# EAGLE design pdbV2.0 (EAGLE 9.6.2)
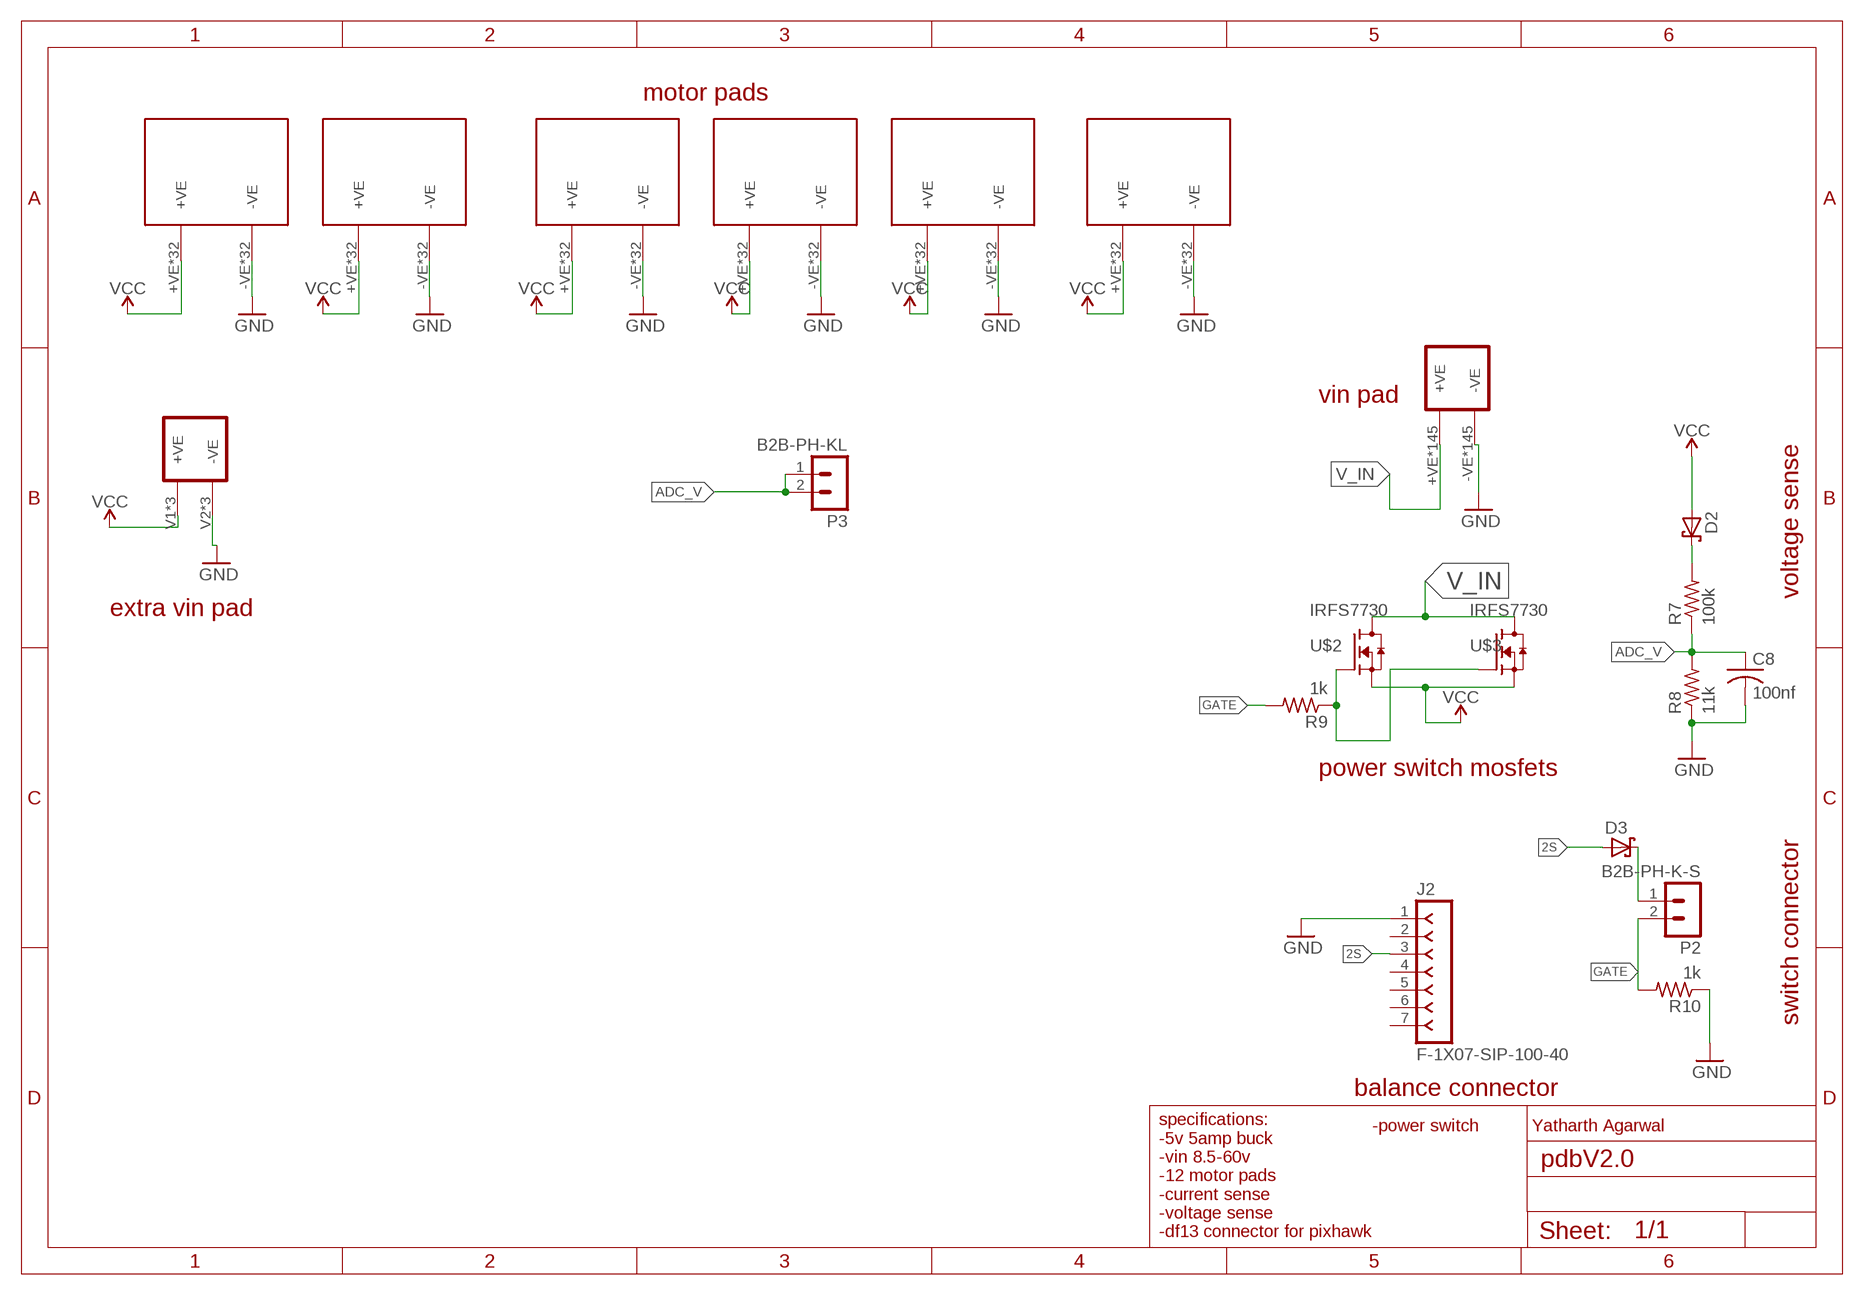
[diagram p0: schematic, sheet 1]

## Parts
C8  100nf  C-USC0805  [C0805]
D2  1PS76SB70,115  [SOD323(F)]
D3  1PS76SB70,115  [SOD323(F)]
J2  F-1X07-SIP-100-40  [SIP-100-07-40]
P2  B2B-PH-K-S  [B2B-PH-K-S]
P3  B2B-PH-KL  [B2B-PH-K-S]
R7  100k  R-US_R0805  [R0805]
R8  11k  R-US_R0805  [R0805]
R9  1k  R-US_R0805  [R0805]
R10  1k  R-US_R0805  [R0805]
T1  BATTERY_PAD  [BATTERY_PAD]
T2  MOTOR_PAD  [MOTOR_PAD]
T3  MOTOR_PAD  [MOTOR_PAD]
T4  MOTOR_PAD  [MOTOR_PAD]
T5  MOTOR_PAD  [MOTOR_PAD]
T6  MOTOR_PAD  [MOTOR_PAD]
T7  MOTOR_PAD  [MOTOR_PAD]
U$1  CONPAD  [CONPAD]
U$2  IRFS7730  [TO254P1524X457-3N]
U$3  IRFS7730  [TO254P1524X457-3N]

## Nets
2S: D3.2(A) J2.3
ADC_V: C8.1 P3.1 P3.2 R7.1 R8.2
GATE: P2.2 R9.2 R10.2
GND: C8.2 J2.1 R8.1 R10.1 T1.-VE T1.-VE_1(-VE) T1.V109(-VE) T1.V110(-VE) T1.V111(-VE) T1.V112(-VE) T1.V113(-VE) T1.V114(-VE) T1.V115(-VE) T1.V116(-VE) T1.V117(-VE) T1.V118(-VE) T1.V119(-VE) T1.V121(-VE) T1.V122(-VE) T1.V123(-VE) T1.V124(-VE) T1.V125(-VE) T1.V126(-VE) T1.V127(-VE) T1.V128(-VE) T1.V129(-VE) T1.V130(-VE) T1.V131(-VE) T1.V133(-VE) T1.V134(-VE) T1.V135(-VE) T1.V136(-VE) T1.V137(-VE) T1.V138(-VE) T1.V139(-VE) T1.V140(-VE) T1.V141(-VE) T1.V142(-VE) T1.V143(-VE) T1.V145(-VE) T1.V146(-VE) T1.V147(-VE) T1.V148(-VE) T1.V149(-VE) T1.V150(-VE) T1.V151(-VE) T1.V152(-VE) T1.V153(-VE) T1.V154(-VE) T1.V155(-VE) T1.V157(-VE) T1.V158(-VE) T1.V159(-VE) T1.V160(-VE) T1.V161(-VE) T1.V162(-VE) T1.V163(-VE) T1.V164(-VE) T1.V165(-VE) T1.V166(-VE) T1.V167(-VE) T1.V169(-VE) T1.V170(-VE) T1.V171(-VE) T1.V172(-VE) T1.V173(-VE) T1.V174(-VE) T1.V175(-VE) T1.V176(-VE) T1.V177(-VE) T1.V178(-VE) T1.V179(-VE) T1.V181(-VE) T1.V182(-VE) T1.V183(-VE) T1.V184(-VE) T1.V185(-VE) T1.V186(-VE) T1.V187(-VE) T1.V188(-VE) T1.V189(-VE) T1.V190(-VE) T1.V191(-VE) T1.V193(-VE) T1.V194(-VE) T1.V195(-VE) T1.V196(-VE) T1.V197(-VE) T1.V198(-VE) T1.V199(-VE) T1.V200(-VE) T1.V201(-VE) T1.V202(-VE) T1.V203(-VE) T1.V232(-VE) T1.V233(-VE) T1.V234(-VE) T1.V235(-VE) T1.V236(-VE) T1.V237(-VE) T1.V238(-VE) T1.V239(-VE) T1.V240(-VE) T1.V241(-VE) T1.V242(-VE) T1.V243(-VE) T1.V244(-VE) T1.V245(-VE) T1.V246(-VE) T1.V247(-VE) T1.V248(-VE) T1.V249(-VE) T1.V250(-VE) T1.V251(-VE) T1.V252(-VE) T1.V253(-VE) T1.V254(-VE) T1.V255(-VE) T1.V256(-VE) T1.V257(-VE) T1.V258(-VE) T1.V259(-VE) T1.V260(-VE) T1.V261(-VE) T1.V262(-VE) T1.V263(-VE) T1.V264(-VE) T1.V265(-VE) T1.V266(-VE) T1.V267(-VE) T1.V268(-VE) T1.V269(-VE) T1.V270(-VE) T1.V271(-VE) T1.V272(-VE) T1.V273(-VE) T1.V274(-VE) T1.V275(-VE) T1.V276(-VE) T1.V277(-VE) T1.V278(-VE) T1.V279(-VE) T1.V280(-VE) T1.V281(-VE) T1.V282(-VE) T1.V283(-VE) T1.V284(-VE) T1.V285(-VE) T1.V286(-VE) T2.-VE T2.-VE_1(-VE) T2.V32(-VE) T2.V33(-VE) T2.V34(-VE) T2.V35(-VE) T2.V36(-VE) T2.V37(-VE) T2.V38(-VE) T2.V39(-VE) T2.V40(-VE) T2.V41(-VE) T2.V42(-VE) T2.V43(-VE) T2.V44(-VE) T2.V45(-VE) T2.V46(-VE) T2.V47(-VE) T2.V48(-VE) T2.V49(-VE) T2.V50(-VE) T2.V51(-VE) T2.V52(-VE) T2.V53(-VE) T2.V54(-VE) T2.V55(-VE) T2.V56(-VE) T2.V57(-VE) T2.V58(-VE) T2.V59(-VE) T2.V60(-VE) T2.V61(-VE) T3.-VE T3.-VE_1(-VE) T3.V32(-VE) T3.V33(-VE) T3.V34(-VE) T3.V35(-VE) T3.V36(-VE) T3.V37(-VE) T3.V38(-VE) T3.V39(-VE) T3.V40(-VE) T3.V41(-VE) T3.V42(-VE) T3.V43(-VE) T3.V44(-VE) T3.V45(-VE) T3.V46(-VE) T3.V47(-VE) T3.V48(-VE) T3.V49(-VE) T3.V50(-VE) T3.V51(-VE) T3.V52(-VE) T3.V53(-VE) T3.V54(-VE) T3.V55(-VE) T3.V56(-VE) T3.V57(-VE) T3.V58(-VE) T3.V59(-VE) T3.V60(-VE) T3.V61(-VE) T4.-VE T4.-VE_1(-VE) T4.V32(-VE) T4.V33(-VE) T4.V34(-VE) T4.V35(-VE) T4.V36(-VE) T4.V37(-VE) T4.V38(-VE) T4.V39(-VE) T4.V40(-VE) T4.V41(-VE) T4.V42(-VE) T4.V43(-VE) T4.V44(-VE) T4.V45(-VE) T4.V46(-VE) T4.V47(-VE) T4.V48(-VE) T4.V49(-VE) T4.V50(-VE) T4.V51(-VE) T4.V52(-VE) T4.V53(-VE) T4.V54(-VE) T4.V55(-VE) T4.V56(-VE) T4.V57(-VE) T4.V58(-VE) T4.V59(-VE) T4.V60(-VE) T4.V61(-VE) T5.-VE T5.-VE_1(-VE) T5.V32(-VE) T5.V33(-VE) T5.V34(-VE) T5.V35(-VE) T5.V36(-VE) T5.V37(-VE) T5.V38(-VE) T5.V39(-VE) T5.V40(-VE) T5.V41(-VE) T5.V42(-VE) T5.V43(-VE) T5.V44(-VE) T5.V45(-VE) T5.V46(-VE) T5.V47(-VE) T5.V48(-VE) T5.V49(-VE) T5.V50(-VE) T5.V51(-VE) T5.V52(-VE) T5.V53(-VE) T5.V54(-VE) T5.V55(-VE) T5.V56(-VE) T5.V57(-VE) T5.V58(-VE) T5.V59(-VE) T5.V60(-VE) T5.V61(-VE) T6.-VE T6.-VE_1(-VE) T6.V32(-VE) T6.V33(-VE) T6.V34(-VE) T6.V35(-VE) T6.V36(-VE) T6.V37(-VE) T6.V38(-VE) T6.V39(-VE) T6.V40(-VE) T6.V41(-VE) T6.V42(-VE) T6.V43(-VE) T6.V44(-VE) T6.V45(-VE) T6.V46(-VE) T6.V47(-VE) T6.V48(-VE) T6.V49(-VE) T6.V50(-VE) T6.V51(-VE) T6.V52(-VE) T6.V53(-VE) T6.V54(-VE) T6.V55(-VE) T6.V56(-VE) T6.V57(-VE) T6.V58(-VE) T6.V59(-VE) T6.V60(-VE) T6.V61(-VE) T7.-VE T7.-VE_1(-VE) T7.V32(-VE) T7.V33(-VE) T7.V34(-VE) T7.V35(-VE) T7.V36(-VE) T7.V37(-VE) T7.V38(-VE) T7.V39(-VE) T7.V40(-VE) T7.V41(-VE) T7.V42(-VE) T7.V43(-VE) T7.V44(-VE) T7.V45(-VE) T7.V46(-VE) T7.V47(-VE) T7.V48(-VE) T7.V49(-VE) T7.V50(-VE) T7.V51(-VE) T7.V52(-VE) T7.V53(-VE) T7.V54(-VE) T7.V55(-VE) T7.V56(-VE) T7.V57(-VE) T7.V58(-VE) T7.V59(-VE) T7.V60(-VE) T7.V61(-VE) U$1.V2(-VE) U$1.V4(-VE) U$1.V6(-VE)
N$8: D3.1(K) P2.1
N$9: D2.1(K) R7.2
N$10: R9.1 U$2.1(G) U$3.1(G)
V_IN: T1.+VE T1.+VE_1(+VE) T1.V1(+VE) T1.V2(+VE) T1.V3(+VE) T1.V4(+VE) T1.V5(+VE) T1.V6(+VE) T1.V7(+VE) T1.V8(+VE) T1.V9(+VE) T1.V10(+VE) T1.V11(+VE) T1.V12(+VE) T1.V13(+VE) T1.V14(+VE) T1.V15(+VE) T1.V16(+VE) T1.V17(+VE) T1.V18(+VE) T1.V19(+VE) T1.V20(+VE) T1.V21(+VE) T1.V22(+VE) T1.V23(+VE) T1.V24(+VE) T1.V25(+VE) T1.V26(+VE) T1.V27(+VE) T1.V28(+VE) T1.V29(+VE) T1.V30(+VE) T1.V31(+VE) T1.V32(+VE) T1.V33(+VE) T1.V34(+VE) T1.V35(+VE) T1.V36(+VE) T1.V37(+VE) T1.V38(+VE) T1.V39(+VE) T1.V40(+VE) T1.V41(+VE) T1.V42(+VE) T1.V43(+VE) T1.V44(+VE) T1.V45(+VE) T1.V46(+VE) T1.V47(+VE) T1.V48(+VE) T1.V49(+VE) T1.V50(+VE) T1.V51(+VE) T1.V52(+VE) T1.V53(+VE) T1.V54(+VE) T1.V55(+VE) T1.V56(+VE) T1.V57(+VE) T1.V58(+VE) T1.V59(+VE) T1.V60(+VE) T1.V61(+VE) T1.V62(+VE) T1.V63(+VE) T1.V64(+VE) T1.V65(+VE) T1.V66(+VE) T1.V67(+VE) T1.V68(+VE) T1.V69(+VE) T1.V70(+VE) T1.V71(+VE) T1.V72(+VE) T1.V73(+VE) T1.V74(+VE) T1.V75(+VE) T1.V76(+VE) T1.V77(+VE) T1.V78(+VE) T1.V79(+VE) T1.V80(+VE) T1.V81(+VE) T1.V82(+VE) T1.V83(+VE) T1.V84(+VE) T1.V85(+VE) T1.V86(+VE) T1.V87(+VE) T1.V88(+VE) T1.V89(+VE) T1.V90(+VE) T1.V91(+VE) T1.V92(+VE) T1.V93(+VE) T1.V94(+VE) T1.V95(+VE) T1.V96(+VE) T1.V97(+VE) T1.V98(+VE) T1.V99(+VE) T1.V100(+VE) T1.V101(+VE) T1.V102(+VE) T1.V103(+VE) T1.V104(+VE) T1.V105(+VE) T1.V106(+VE) T1.V107(+VE) T1.V108(+VE) T1.V120(+VE) T1.V132(+VE) T1.V144(+VE) T1.V156(+VE) T1.V168(+VE) T1.V180(+VE) T1.V192(+VE) T1.V204(+VE) T1.V205(+VE) T1.V206(+VE) T1.V207(+VE) T1.V208(+VE) T1.V209(+VE) T1.V210(+VE) T1.V211(+VE) T1.V212(+VE) T1.V213(+VE) T1.V214(+VE) T1.V215(+VE) T1.V216(+VE) T1.V217(+VE) T1.V218(+VE) T1.V219(+VE) T1.V220(+VE) T1.V221(+VE) T1.V222(+VE) T1.V223(+VE) T1.V224(+VE) T1.V225(+VE) T1.V226(+VE) T1.V227(+VE) T1.V228(+VE) T1.V229(+VE) T1.V230(+VE) T1.V231(+VE) U$2.2(D) U$3.2(D)
VCC: D2.2(A) T2.+VE T2.+VE_1(+VE) T2.V1(+VE) T2.V3(+VE) T2.V4(+VE) T2.V5(+VE) T2.V6(+VE) T2.V7(+VE) T2.V8(+VE) T2.V9(+VE) T2.V10(+VE) T2.V11(+VE) T2.V12(+VE) T2.V13(+VE) T2.V14(+VE) T2.V15(+VE) T2.V16(+VE) T2.V17(+VE) T2.V18(+VE) T2.V19(+VE) T2.V20(+VE) T2.V21(+VE) T2.V22(+VE) T2.V23(+VE) T2.V24(+VE) T2.V25(+VE) T2.V26(+VE) T2.V27(+VE) T2.V28(+VE) T2.V29(+VE) T2.V30(+VE) T2.V31(+VE) T3.+VE T3.+VE_1(+VE) T3.V1(+VE) T3.V3(+VE) T3.V4(+VE) T3.V5(+VE) T3.V6(+VE) T3.V7(+VE) T3.V8(+VE) T3.V9(+VE) T3.V10(+VE) T3.V11(+VE) T3.V12(+VE) T3.V13(+VE) T3.V14(+VE) T3.V15(+VE) T3.V16(+VE) T3.V17(+VE) T3.V18(+VE) T3.V19(+VE) T3.V20(+VE) T3.V21(+VE) T3.V22(+VE) T3.V23(+VE) T3.V24(+VE) T3.V25(+VE) T3.V26(+VE) T3.V27(+VE) T3.V28(+VE) T3.V29(+VE) T3.V30(+VE) T3.V31(+VE) T4.+VE T4.+VE_1(+VE) T4.V1(+VE) T4.V3(+VE) T4.V4(+VE) T4.V5(+VE) T4.V6(+VE) T4.V7(+VE) T4.V8(+VE) T4.V9(+VE) T4.V10(+VE) T4.V11(+VE) T4.V12(+VE) T4.V13(+VE) T4.V14(+VE) T4.V15(+VE) T4.V16(+VE) T4.V17(+VE) T4.V18(+VE) T4.V19(+VE) T4.V20(+VE) T4.V21(+VE) T4.V22(+VE) T4.V23(+VE) T4.V24(+VE) T4.V25(+VE) T4.V26(+VE) T4.V27(+VE) T4.V28(+VE) T4.V29(+VE) T4.V30(+VE) T4.V31(+VE) T5.+VE T5.+VE_1(+VE) T5.V1(+VE) T5.V3(+VE) T5.V4(+VE) T5.V5(+VE) T5.V6(+VE) T5.V7(+VE) T5.V8(+VE) T5.V9(+VE) T5.V10(+VE) T5.V11(+VE) T5.V12(+VE) T5.V13(+VE) T5.V14(+VE) T5.V15(+VE) T5.V16(+VE) T5.V17(+VE) T5.V18(+VE) T5.V19(+VE) T5.V20(+VE) T5.V21(+VE) T5.V22(+VE) T5.V23(+VE) T5.V24(+VE) T5.V25(+VE) T5.V26(+VE) T5.V27(+VE) T5.V28(+VE) T5.V29(+VE) T5.V30(+VE) T5.V31(+VE) T6.+VE T6.+VE_1(+VE) T6.V1(+VE) T6.V3(+VE) T6.V4(+VE) T6.V5(+VE) T6.V6(+VE) T6.V7(+VE) T6.V8(+VE) T6.V9(+VE) T6.V10(+VE) T6.V11(+VE) T6.V12(+VE) T6.V13(+VE) T6.V14(+VE) T6.V15(+VE) T6.V16(+VE) T6.V17(+VE) T6.V18(+VE) T6.V19(+VE) T6.V20(+VE) T6.V21(+VE) T6.V22(+VE) T6.V23(+VE) T6.V24(+VE) T6.V25(+VE) T6.V26(+VE) T6.V27(+VE) T6.V28(+VE) T6.V29(+VE) T6.V30(+VE) T6.V31(+VE) T7.+VE T7.+VE_1(+VE) T7.V1(+VE) T7.V3(+VE) T7.V4(+VE) T7.V5(+VE) T7.V6(+VE) T7.V7(+VE) T7.V8(+VE) T7.V9(+VE) T7.V10(+VE) T7.V11(+VE) T7.V12(+VE) T7.V13(+VE) T7.V14(+VE) T7.V15(+VE) T7.V16(+VE) T7.V17(+VE) T7.V18(+VE) T7.V19(+VE) T7.V20(+VE) T7.V21(+VE) T7.V22(+VE) T7.V23(+VE) T7.V24(+VE) T7.V25(+VE) T7.V26(+VE) T7.V27(+VE) T7.V28(+VE) T7.V29(+VE) T7.V30(+VE) T7.V31(+VE) U$1.V1(+VE) U$1.V3(+VE) U$1.V5(+VE) U$2.3(S) U$3.3(S)
Unconnected: J2.2 J2.4 J2.5 J2.6 J2.7

## Notes on the sheet
- motor pads
- vin pad
- voltage sense
- extra vin pad
- power switch mosfets
- switch connector
- balance connector
- -power switch | Yatharth Agarwal
- specifications:
  -5v 5amp buck
  -vin 8.5-60v
  -12 motor pads
  -current sense
  -voltage sense
  -df13 connector for pixhawk

## Library data of the parts
C8 = rcl:C-US: CAPACITOR, American symbol; SPICEPREFIX: C
D2 D3 = 1PS76SB70_115:1PS76SB70,115: General-purpose Schottky diode General-purpose Schottky diodes in small Surface-Mounted Device (SMD) plastic packages. AAL Eindhoven MK Check prices <https://pricing.snapeda.com/parts/1PS76SB70%2C115/Nexperia%20USA/view-part?ref=eda>; AVAILABILITY: Good; DESCRIPTION: Diode Schottky 70V 70mA (DC) Surface Mount SOD-323; MF: Nexperia USA; MP: 1PS76SB70,115; PACKAGE: SOD323-2 Nexperia USA Inc.; PRICE: None; PURCHASE-URL: https://pricing.snapeda.com/search/part/1PS76SB70,115/?ref=eda
J2 = con-headers-jp:F-1X07-: FEMALE HEADER
P2 P3 = con-JST PH:B2B-PH: JST PH series header 2.00mm pitch disconnectable crimp style connectors, vertical (side entry type), 2 pins
R7-R10 = rcl:R-US_: RESISTOR, American symbol; SPICEPREFIX: R
T1 = pcbV1:BATTERY_PAD
T2-T7 = pcbV1:MOTOR_PAD
U$1 = pcbV1:CONPAD
U$2 U$3 = pcbV1:IRFS7730

## Board
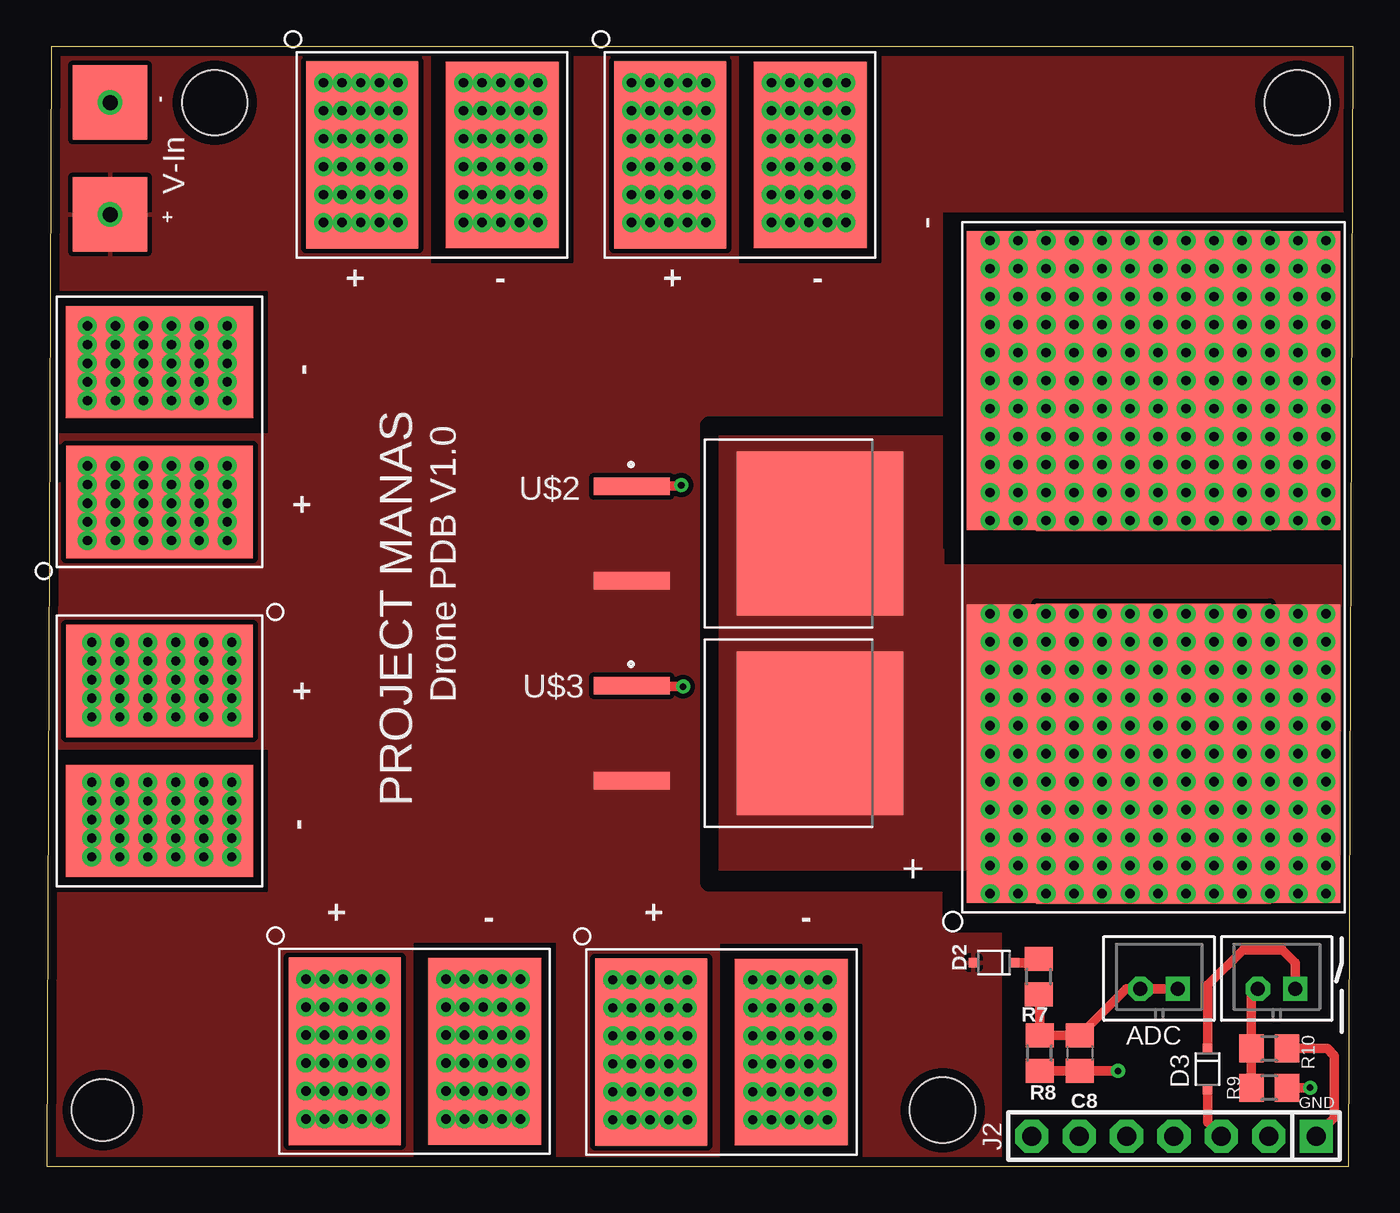
[diagram p1: board, top side]
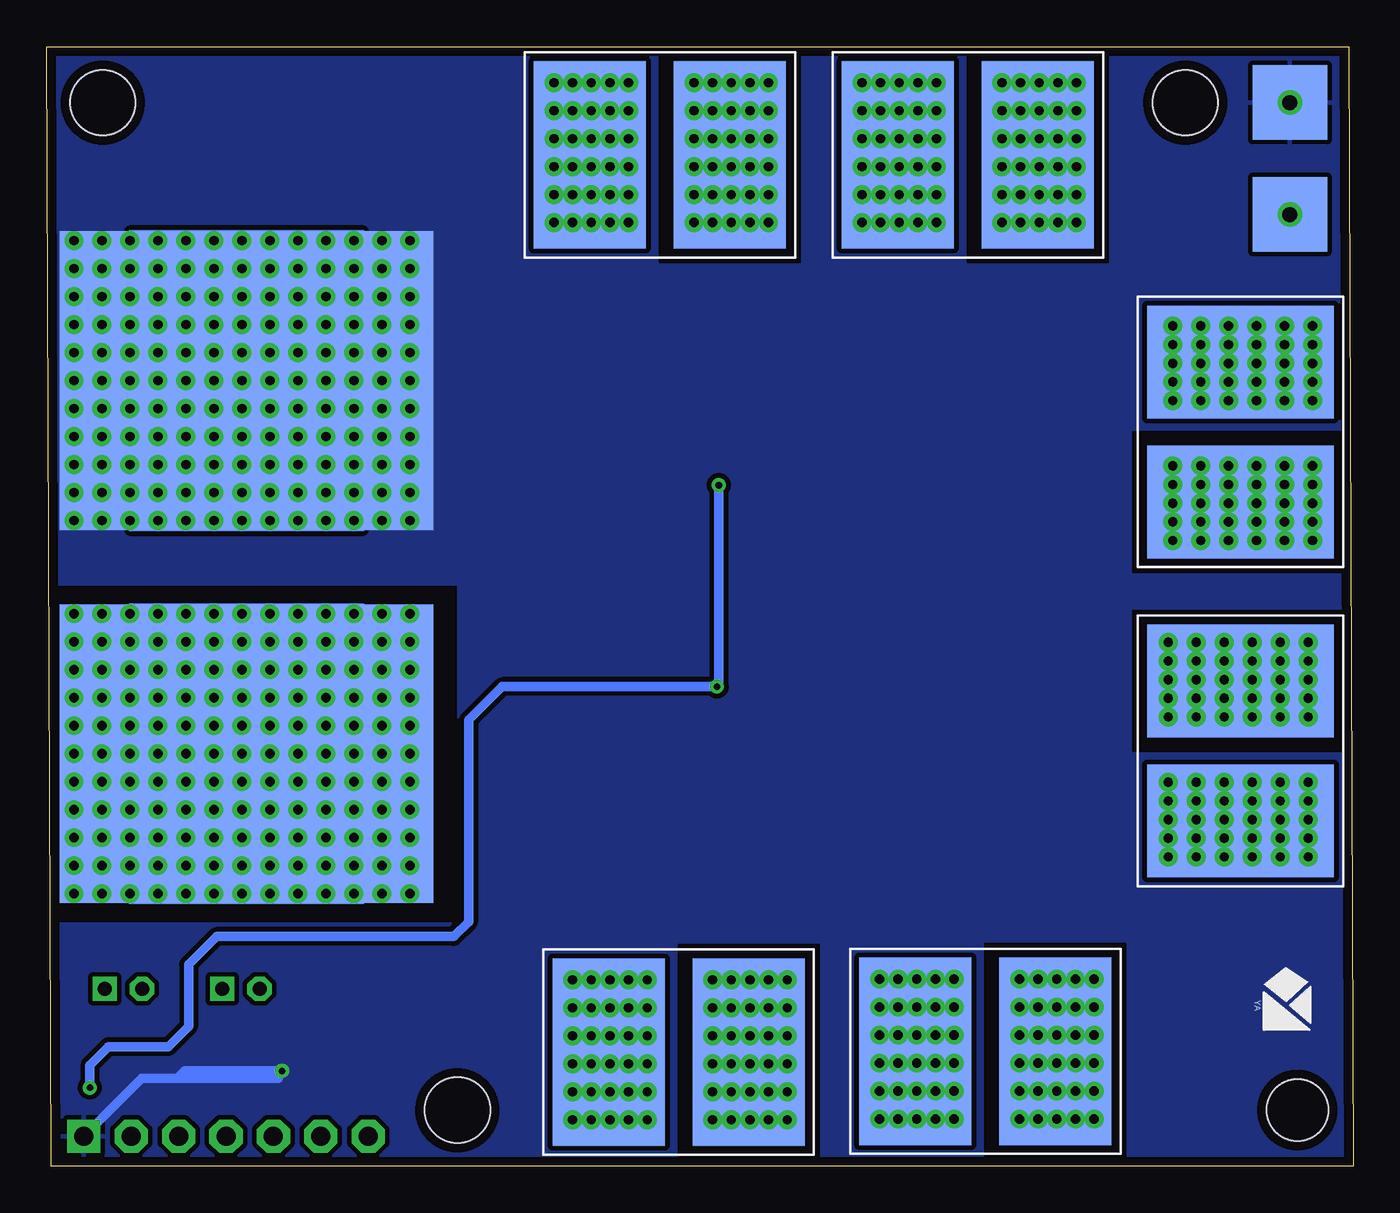
[diagram p2: board, bottom side, seen from below]

Size 70.01 x 60 mm. Coordinates in mm from the lower left corner, seen from the top.
Outline: 0,0 69.76,0 70.01,60 0.25,60 0,0
Copper layers (1*16): Top 0.035mm / dielectric 1.5mm / Bottom 0.035mm
Design rules "default *": minimum track width 0.25mm, minimum drill 0.35mm, track to track 10mil, track to pad 10mil, pad to pad 6mil, via to via 6mil, smd to smd 6mil, copper to edge 0.5mm, drill to drill 6mil, minimum pad ring 10mil, minimum via ring 8mil, stop-mask expansion 4mil, vias tented up to drill 0mil, thermal gap 10mil
Holes 3.3 mm at 3,3
Holes 3.5 mm at 67,57 48,3 9,57
tRestrict: 6 lines

### Footprints (pad centres in the part's own frame; a part is rotated, then mirrored left to right if it is on the bottom)
C0805 = smd 1.3 x 1.5: 1 -0.95,0; 2 0.95,0
SOD323(F) = smd 0.5 x 0.5: 1 1.1,0; 2 -1.1,0
SIP-100-07-40 = drill 1.016 pad 1.778 square: 1 -7.62,0 | drill 1.016 pad 1.778 octagon: 2 -5.08,0; 3 -2.54,0; 4 0,0; 5 2.54,0; 6 5.08,0; 7 7.62,0
B2B-PH-K-S = drill 0.75 pad 1.3 square: 1 1,0 | drill 0.75 pad 1.3 octagon: 2 -1,0
R0805 = smd 1.3 x 1.5: 1 -0.95,0; 2 0.95,0
BATTERY_PAD = smd 16 x 20 bottom: +VE -10,0.75; -VE 10,0.75 | smd 16 x 20: +VE_1 -10,0.75; -VE_1 10,0.75 | drill 0.5 pad 0.8: V1 -17.5,8; V2 -17.5,2; V3 -16,2; V4 -14.5,2; V5 -13,2; V6 -11.5,2; V7 -10,2; V8 -8.5,2; V9 -7,2; V10 -5.5,2; V11 -4,2; V12 -2.5,2; V13 -16,8; V14 -17.5,0.5; V15 -16,0.5; V16 -14.5,0.5; V17 -13,0.5; V18 -11.5,0.5; V19 -10,0.5; V20 -8.5,0.5; V21 -7,0.5; V22 -5.5,0.5; V23 -4,0.5; V24 -2.5,0.5; V25 -14.5,8; V26 -17.5,-1; V27 -16,-1; V28 -14.5,-1; V29 -13,-1; V30 -11.5,-1; V31 -10,-1; V32 -8.5,-1; V33 -7,-1; V34 -5.5,-1; V35 -4,-1; V36 -2.5,-1; V37 -13,8; V38 -17.5,-2.5; V39 -16,-2.5; V40 -14.5,-2.5; V41 -13,-2.5; V42 -11.5,-2.5; V43 -10,-2.5; V44 -8.5,-2.5; V45 -7,-2.5; V46 -5.5,-2.5; V47 -4,-2.5; V48 -2.5,-2.5; V49 -11.5,8; V50 -17.5,-4; V51 -16,-4; V52 -14.5,-4; V53 -13,-4; V54 -11.5,-4; V55 -10,-4; V56 -8.5,-4; V57 -7,-4; V58 -5.5,-4; V59 -4,-4; V60 -2.5,-4; V61 -10,8; V62 -17.5,-5.5; V63 -16,-5.5; V64 -14.5,-5.5; V65 -13,-5.5; V66 -11.5,-5.5; V67 -10,-5.5; V68 -8.5,-5.5; V69 -7,-5.5; V70 -5.5,-5.5; V71 -4,-5.5; V72 -2.5,-5.5; V73 -8.5,8; V74 -17.5,-7; V75 -16,-7; V76 -14.5,-7; V77 -13,-7; V78 -11.5,-7; V79 -10,-7; V80 -8.5,-7; V81 -7,-7; V82 -5.5,-7; V83 -4,-7; V84 -2.5,-7; V85 -7,8; V86 -17.5,-8.5; V87 -16,-8.5; V88 -14.5,-8.5; V89 -13,-8.5; V90 -11.5,-8.5; V91 -10,-8.5; V92 -8.5,-8.5; V93 -7,-8.5; V94 -5.5,-8.5; V95 -4,-8.5; V96 -2.5,-8.5; V97 -5.5,8; V98 -4,8; V99 -2.5,8; V100 -17.5,6.5; V101 -16,6.5; V102 -14.5,6.5; V103 -13,6.5; V104 -11.5,6.5; V105 -10,6.5; V106 -8.5,6.5; V107 -7,6.5; V108 -5.5,6.5; V109 2.5,2; V110 4,2; V111 5.5,2; V112 7,2; V113 8.5,2; V114 10,2; V115 11.5,2; V116 13,2; V117 14.5,2; V118 16,2; V119 17.5,2; V120 -4,6.5; V121 2.5,0.5; V122 4,0.5; V123 5.5,0.5; V124 7,0.5; V125 8.5,0.5; V126 10,0.5; V127 11.5,0.5; V128 13,0.5; V129 14.5,0.5; V130 16,0.5; V131 17.5,0.5; V132 -2.5,6.5; V133 2.5,-1; V134 4,-1; V135 5.5,-1; V136 7,-1; V137 8.5,-1; V138 10,-1; V139 11.5,-1; V140 13,-1; V141 14.5,-1; V142 16,-1; V143 17.5,-1; V144 -17.5,5; V145 2.5,-2.5; V146 4,-2.5; V147 5.5,-2.5; V148 7,-2.5; V149 8.5,-2.5; V150 10,-2.5; V151 11.5,-2.5; V152 13,-2.5; V153 14.5,-2.5; V154 16,-2.5; V155 17.5,-2.5; V156 -16,5; V157 2.5,-4; V158 4,-4; V159 5.5,-4; V160 7,-4; V161 8.5,-4; V162 10,-4; V163 11.5,-4; V164 13,-4; V165 14.5,-4; V166 16,-4; V167 17.5,-4; V168 -14.5,5; V169 2.5,-5.5; V170 4,-5.5; V171 5.5,-5.5; V172 7,-5.5; V173 8.5,-5.5; V174 10,-5.5; V175 11.5,-5.5; V176 13,-5.5; V177 14.5,-5.5; V178 16,-5.5; V179 17.5,-5.5; V180 -13,5; V181 2.5,-7; V182 4,-7; V183 5.5,-7; V184 7,-7; V185 8.5,-7; V186 10,-7; V187 11.5,-7; V188 13,-7; V189 14.5,-7; V190 16,-7; V191 17.5,-7; V192 -11.5,5; V193 2.5,-8.5; V194 4,-8.5; V195 5.5,-8.5; V196 7,-8.5; V197 8.5,-8.5; V198 10,-8.5; V199 11.5,-8.5; V200 13,-8.5; V201 14.5,-8.5; V202 16,-8.5; V203 17.5,-8.5; V204 -10,5; V205 -8.5,5; V206 -7,5; V207 -5.5,5; V208 -4,5; V209 -2.5,5; V210 -17.5,3.5; V211 -16,3.5; V212 -14.5,3.5; V213 -13,3.5; V214 -11.5,3.5; V215 -10,3.5; V216 -8.5,3.5; V217 -7,3.5; V218 -5.5,3.5; V219 -4,3.5; V220 -2.5,3.5; V221 -17.5,9.5; V222 -16,9.5; V223 -14.5,9.5; V224 -13,9.5; V225 -11.5,9.5; V226 -10,9.5; V227 -8.5,9.5; V228 -7,9.5; V229 -5.5,9.5; V230 -4,9.5; V231 -2.5,9.5; V232 2.5,8; V233 4,8; V234 5.5,8; V235 7,8; V236 8.5,8; V237 10,8; V238 11.5,8; V239 13,8; V240 14.5,8; V241 16,8; V242 17.5,8; V243 2.5,6.5; V244 4,6.5; V245 5.5,6.5; V246 7,6.5; V247 8.5,6.5; V248 10,6.5; V249 11.5,6.5; V250 13,6.5; V251 14.5,6.5; V252 16,6.5; V253 17.5,6.5; V254 2.5,5; V255 4,5; V256 5.5,5; V257 7,5; V258 8.5,5; V259 10,5; V260 11.5,5; V261 13,5; V262 14.5,5; V263 16,5; V264 17.5,5; V265 2.5,3.5; V266 4,3.5; V267 5.5,3.5; V268 7,3.5; V269 8.5,3.5; V270 10,3.5; V271 11.5,3.5; V272 13,3.5; V273 14.5,3.5; V274 16,3.5; V275 17.5,3.5; V276 2.5,9.5; V277 4,9.5; V278 5.5,9.5; V279 7,9.5; V280 8.5,9.5; V281 10,9.5; V282 11.5,9.5; V283 13,9.5; V284 14.5,9.5; V285 16,9.5; V286 17.5,9.5
MOTOR_PAD = smd 6 x 10: +VE -4,0; -VE 3.5,0 | smd 6 x 10 bottom: +VE_1 -4,0; -VE_1 3.5,0 | drill 0.5 pad 0.8: V1 -6.07,3.87; V3 -5.07,3.87; V4 -4.07,3.87; V5 -3.07,3.87; V6 -2.07,3.87; V7 -6.07,2.37; V8 -5.07,2.37; V9 -4.07,2.37; V10 -3.07,2.37; V11 -2.07,2.37; V12 -6.07,0.87; V13 -5.07,0.87; V14 -4.07,0.87; V15 -3.07,0.87; V16 -2.07,0.87; V17 -2.07,-0.63; V18 -3.07,-0.63; V19 -4.07,-0.63; V20 -5.07,-0.63; V21 -6.07,-0.63; V22 -6.07,-2.13; V23 -5.07,-2.13; V24 -4.07,-2.13; V25 -3.07,-2.13; V26 -2.07,-2.13; V27 -2.07,-3.63; V28 -3.07,-3.63; V29 -4.07,-3.63; V30 -5.07,-3.63; V31 -6.07,-3.63; V32 1.43,3.87; V33 2.43,3.87; V34 3.43,3.87; V35 4.43,3.87; V36 5.43,3.87; V37 1.43,2.37; V38 2.43,2.37; V39 3.43,2.37; V40 4.43,2.37; V41 5.43,2.37; V42 1.43,0.87; V43 2.43,0.87; V44 3.43,0.87; V45 4.43,0.87; V46 5.43,0.87; V47 5.43,-0.63; V48 4.43,-0.63; V49 3.43,-0.63; V50 2.43,-0.63; V51 1.43,-0.63; V52 1.43,-2.13; V53 2.43,-2.13; V54 3.43,-2.13; V55 4.43,-2.13; V56 5.43,-2.13; V57 5.43,-3.63; V58 4.43,-3.63; V59 3.43,-3.63; V60 2.43,-3.63; V61 1.43,-3.63
CONPAD = smd 4 x 4: V1 -3,0; V2 3,0 | smd 4 x 4 bottom: V3 -3,0; V4 3,0 | drill 0.8: V5 -3,0; V6 3,0
TO254P1524X457-3N = smd 4.07 x 0.94: 1 -6.26,2.54; 3 -6.26,-2.54 | smd 8.92 x 8.77: 2 3.83,0

### Placement (x,y rotation side)
C8  55.35,6.05 270 top
D2  50.75,10.9 0 top
D3  62.2,5.2 90 top
J2  60.4,1.6 180 top
P2  65.9,9.5 0 top
P3  59.6,9.5 0 top
R7  53.15,10.15 90 top
R8  53.2,6.05 90 top
R9  65.5,4.2 180 top
R10  65.5,6.3 180 top
T1  60.05,32.1 90 top
T2  19.96,6.15 0 top
T3  6.05,22 270 top
T4  36.4,6.11 0 top
T5  20.9,54.2 0 top
T6  37.4,54.2 0 top
T7  6.05,39.6 90 top
U$1  3.4,54 90 top
U$2  37.6,33.9 0 top
U$3  37.6,23.2 0 top

### Tracks (layer width: path | path; a pad name or v marks a point on that pad's centre or on a via)
2S
  Top 0.5: J2.3 62.2,2.34 D3.2
ADC_V
  Top 0.5: R7.1 53.2,9.15 R8.2 C8.1 57.85,9.5 P3.2 P3.1
GATE
  Top 0.5: R9.2 R10.2 64.55,9.15 P2.2
GND  (via drill 0.35)  (7 unrouted)
  Top 0.5: R8.1 C8.2 v57.4,5.1 | J2.1 69,2.58 69,5.9 68.6,6.3 R10.1
  Bottom 0.5: 63,4.7 64.92,4.7 J2.1 | 63,4.7 57.6,4.7 | v57.4,5.1 62.6,5.1 63,4.7
  pour Bottom: 0.51,59.75 69.75,59.75 69.75,0 0.25,0 0.25,59.49
  pour Bottom (no thermals): 48,50.6 48,33 69.8,33 69.8,50.6
N$8
  Top 0.5: P2.1 66.9,10.9 66.2,11.6 64.1,11.6 62.2,9.7 D3.1
N$9
  Top 0.5: R7.2 52.95,10.9 D2.1
N$10  (via drill 0.35)
  Top 0.5: U$2.1 33.94,36.44 v34,36.5 | v34.1,25.7 31.38,25.7 U$3.1 | v67.7,4.2 R9.1
  Bottom 0.5: v34,36.5 34,25.8 v34.1,25.7 45.6,25.7 47.4,23.9 47.4,13.1 48.2,12.3 60.9,12.3 62.4,10.8 62.4,7.5 63.5,6.4 66.7,6.4 67.7,5.4 v67.7,4.2
V_IN  (1 unrouted)
  Top 0.25: T1.V221 50.65,14.62 50.65,15.88 T1.V222 | T1.V1 52.16,14.62 52.16,15.88 T1.V13 | T1.V100 53.68,14.62 53.68,15.88 T1.V101 | T1.V144 55.19,14.62 55.19,15.88 T1.V156 | T1.V210 56.7,14.62 56.7,15.88 T1.V211 | T1.V2 58.21,14.62 58.21,15.88 T1.V3 | T1.V14 59.72,14.62 59.72,15.88 T1.V15 | T1.V26 61.24,14.62 61.24,15.88 T1.V27 | T1.V38 62.75,14.62 62.75,15.88 T1.V39 | T1.V50 64.26,14.62 64.26,15.88 T1.V51 | T1.V62 65.77,14.62 65.77,15.88 T1.V63 | T1.V74 67.28,14.62 67.28,15.88 T1.V75 | T1.V86 68.8,14.62 68.8,15.88 T1.V87
  pour Top (no thermals): 69.3,15.9 35.5,15.9 35.5,39.2 48,39.2 48,32.2 69.3,32.2
VCC  (6 unrouted)
  pour Top (rank 2): 0.1,59.9 69.7,59.9 69.7,12.9 51.1,12.9 51.1,0.1 0.1,0.1
  pour Top (no thermals): 34.2,32.6 27.8,32.6 27.8,18.9 33.9,18.9 33.9,18.8 34.2,18.8

### Text on the board
tPlace: - | + | ADC | GND
tNames: - | V-In | + | + | - | + | - | - | PROJECT MANAS | Drone PDB V1.0 | + | + | - | - | - | + | +
bNames: YA